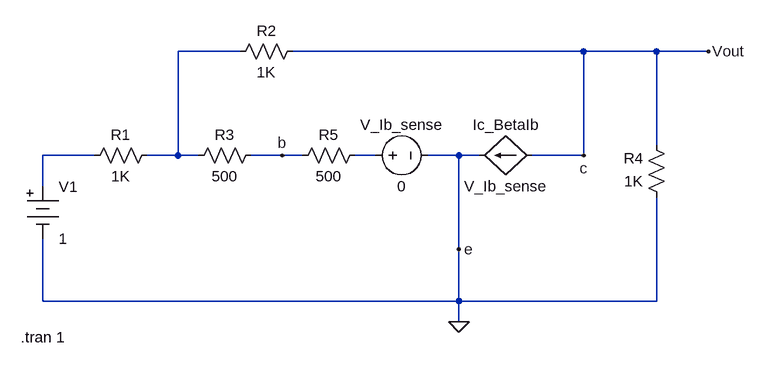
[diagram p0: schematic g3_p20.asc]
g3_p20.asc, the LTspice schematic file:
Version 4
SHEET 1 968 680
WIRE 176 -16 80 -16
WIRE 704 -16 256 -16
WIRE 816 -16 704 -16
WIRE 896 -16 816 -16
WIRE 816 128 816 -16
WIRE -48 144 -128 144
WIRE 80 144 80 -16
WIRE 80 144 32 144
WIRE 112 144 80 144
WIRE 240 144 192 144
WIRE 272 144 240 144
WIRE 384 144 352 144
WIRE 512 144 464 144
WIRE 544 144 512 144
WIRE 704 144 704 -16
WIRE 704 144 624 144
WIRE -128 192 -128 144
WIRE 512 288 512 144
WIRE -128 368 -128 272
WIRE 512 368 512 288
WIRE 512 368 -128 368
WIRE 816 368 816 208
WIRE 816 368 512 368
WIRE 512 400 512 368
FLAG 512 400 0
FLAG 896 -16 Vout
FLAG 512 288 e
FLAG 240 144 b
FLAG 704 144 c
SYMBOL Misc\\battery -128 176 R0
SYMATTR InstName V1
SYMATTR Value 1
SYMBOL res 48 128 R90
WINDOW 0 0 56 VBottom 2
WINDOW 3 32 56 VTop 2
SYMATTR InstName R1
SYMATTR Value 1K
SYMBOL res 272 -32 R90
WINDOW 0 0 56 VBottom 2
WINDOW 3 32 56 VTop 2
SYMATTR InstName R2
SYMATTR Value 1K
SYMBOL res 208 128 R90
WINDOW 0 0 56 VBottom 2
WINDOW 3 32 56 VTop 2
SYMATTR InstName R3
SYMATTR Value 500
SYMBOL res 832 224 R180
WINDOW 0 36 76 Left 2
WINDOW 3 36 40 Left 2
SYMATTR InstName R4
SYMATTR Value 1K
SYMBOL f 624 144 R90
WINDOW 0 -32 40 VBottom 2
WINDOW 3 32 40 VTop 2
SYMATTR InstName Ic_BetaIb
SYMATTR Value V_Ib_sense
SYMATTR Value2 100
SYMBOL voltage 368 144 R270
WINDOW 0 32 56 VTop 2
WINDOW 3 -32 56 VBottom 2
SYMATTR InstName V_Ib_sense
SYMATTR Value 0
SYMBOL res 368 128 R90
WINDOW 0 0 56 VBottom 2
WINDOW 3 32 56 VTop 2
SYMATTR InstName R5
SYMATTR Value 500
TEXT -162 424 Left 2 !.tran 1

The netlist it stands for:
* g3_p20.asc
V1 N002 0 1
R1 N001 N002 1K
R2 c N001 1K
R3 b N001 500
R4 0 c 1K
F§Ic_BetaIb c 0 V_Ib_sense 100
V_Ib_sense N003 0 0
R5 N003 b 500
.tran 1
.backanno
.end